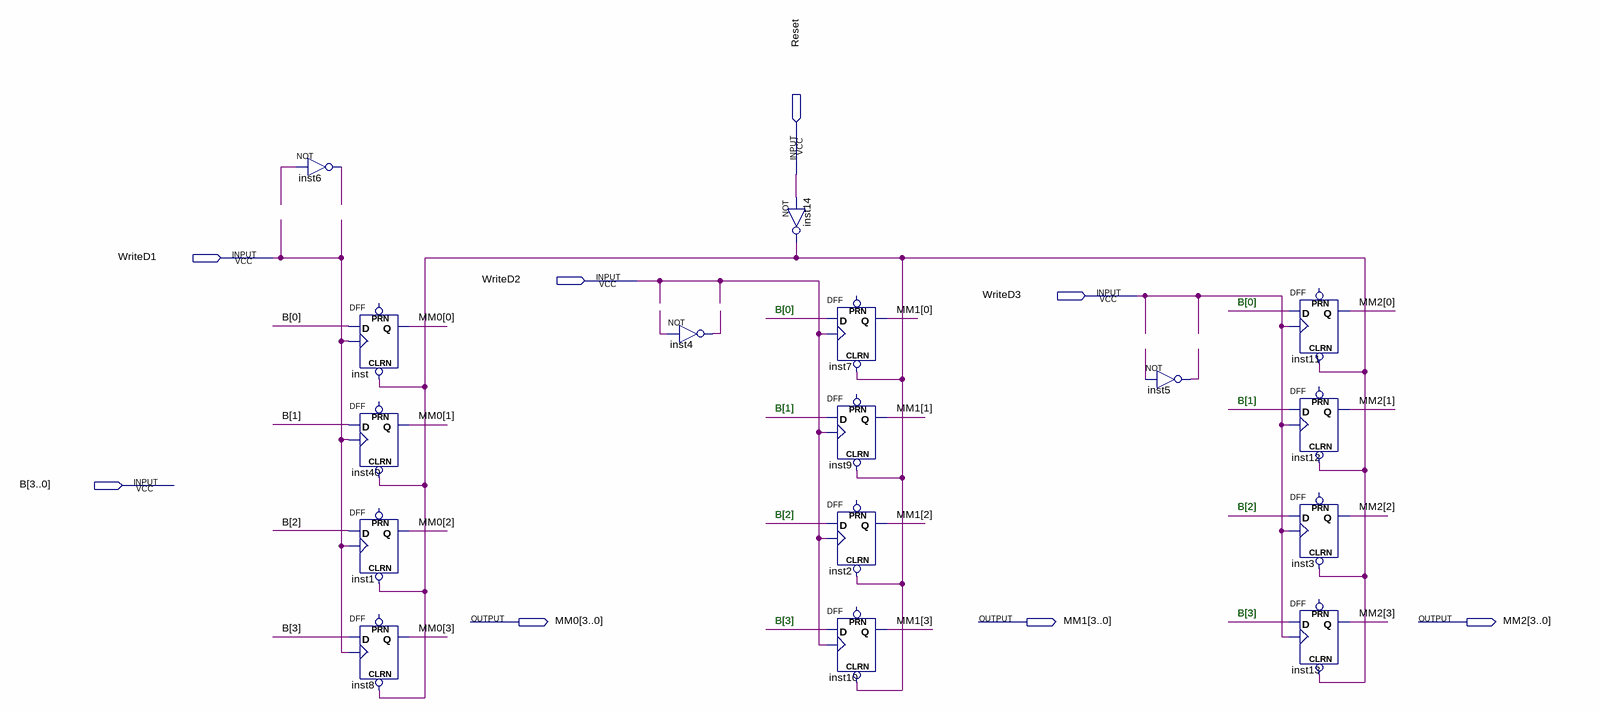
[diagram p0: schematic sheet]
// Quartus schematic registrador.bdf as structural Verilog: 16 symbols, 8 pins
module registrador (
  input  Reset,
  input  WriteD1,
  input  WriteD2,
  input  WriteD3,
  input  [3:0] B,
  output [3:0] MM0,
  output [3:0] MM1,
  output [3:0] MM2
);

  wire inst4_out, inst5_out, inst6_out, inst14_out, undriven, undriven_2, undriven_3;

  not inst6 (inst6_out, undriven);
  DFF inst (.CLRN(inst14_out), .CLK(WriteD1), .D(B[0]), .Q(MM0[0]));  // open: PRN
  DFF inst40 (.CLRN(inst14_out), .CLK(WriteD1), .D(B[1]), .Q(MM0[1]));  // open: PRN
  DFF inst1 (.CLRN(inst14_out), .CLK(WriteD1), .D(B[2]), .Q(MM0[2]));  // open: PRN
  DFF inst8 (.CLRN(inst14_out), .CLK(WriteD1), .D(B[3]), .Q(MM0[3]));  // open: PRN
  not inst4 (inst4_out, undriven_2);
  not inst14 (inst14_out, Reset);
  DFF inst7 (.CLRN(inst14_out), .CLK(WriteD2), .D(B[0]), .Q(MM1[0]));  // open: PRN
  DFF inst9 (.CLRN(inst14_out), .CLK(WriteD2), .D(B[1]), .Q(MM1[1]));  // open: PRN
  DFF inst2 (.CLRN(inst14_out), .CLK(WriteD2), .D(B[2]), .Q(MM1[2]));  // open: PRN
  DFF inst10 (.CLRN(inst14_out), .CLK(WriteD2), .D(B[3]), .Q(MM1[3]));  // open: PRN
  not inst5 (inst5_out, undriven_3);
  DFF inst11 (.CLRN(inst14_out), .CLK(WriteD3), .D(B[0]), .Q(MM2[0]));  // open: PRN
  DFF inst12 (.CLRN(inst14_out), .CLK(WriteD3), .D(B[1]), .Q(MM2[1]));  // open: PRN
  DFF inst3 (.CLRN(inst14_out), .CLK(WriteD3), .D(B[2]), .Q(MM2[2]));  // open: PRN
  DFF inst13 (.CLRN(inst14_out), .CLK(WriteD3), .D(B[3]), .Q(MM2[3]));  // open: PRN

  // Notes on the sheet:
  //   B[0]
  //   B[0]
  //   B[1]
  //   B[1]
  //   B[2]
  //   B[2]
  //   B[3]
  //   B[3]
endmodule
